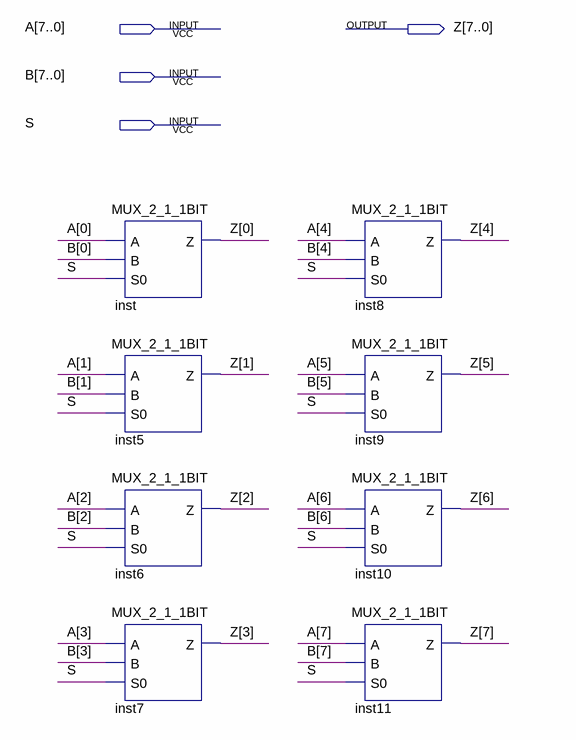
[diagram p0: schematic sheet]
// Quartus schematic MUX_2_1_8BITS.bdf as structural Verilog: 8 symbols, 4 pins
module MUX_2_1_8BITS (
  input  [7:0] A,
  input  [7:0] B,
  input  S,
  output [7:0] Z
);

  MUX_2_1_1BIT inst (.A(A[0]), .B(B[0]), .S0(S), .Z(Z[0]));
  MUX_2_1_1BIT inst5 (.A(A[1]), .B(B[1]), .S0(S), .Z(Z[1]));
  MUX_2_1_1BIT inst6 (.A(A[2]), .B(B[2]), .S0(S), .Z(Z[2]));
  MUX_2_1_1BIT inst7 (.A(A[3]), .B(B[3]), .S0(S), .Z(Z[3]));
  MUX_2_1_1BIT inst8 (.A(A[4]), .B(B[4]), .S0(S), .Z(Z[4]));
  MUX_2_1_1BIT inst9 (.A(A[5]), .B(B[5]), .S0(S), .Z(Z[5]));
  MUX_2_1_1BIT inst10 (.A(A[6]), .B(B[6]), .S0(S), .Z(Z[6]));
  MUX_2_1_1BIT inst11 (.A(A[7]), .B(B[7]), .S0(S), .Z(Z[7]));
endmodule
